# EAGLE schematic Pacman2-OSH-panels (EAGLE 9.2.2)
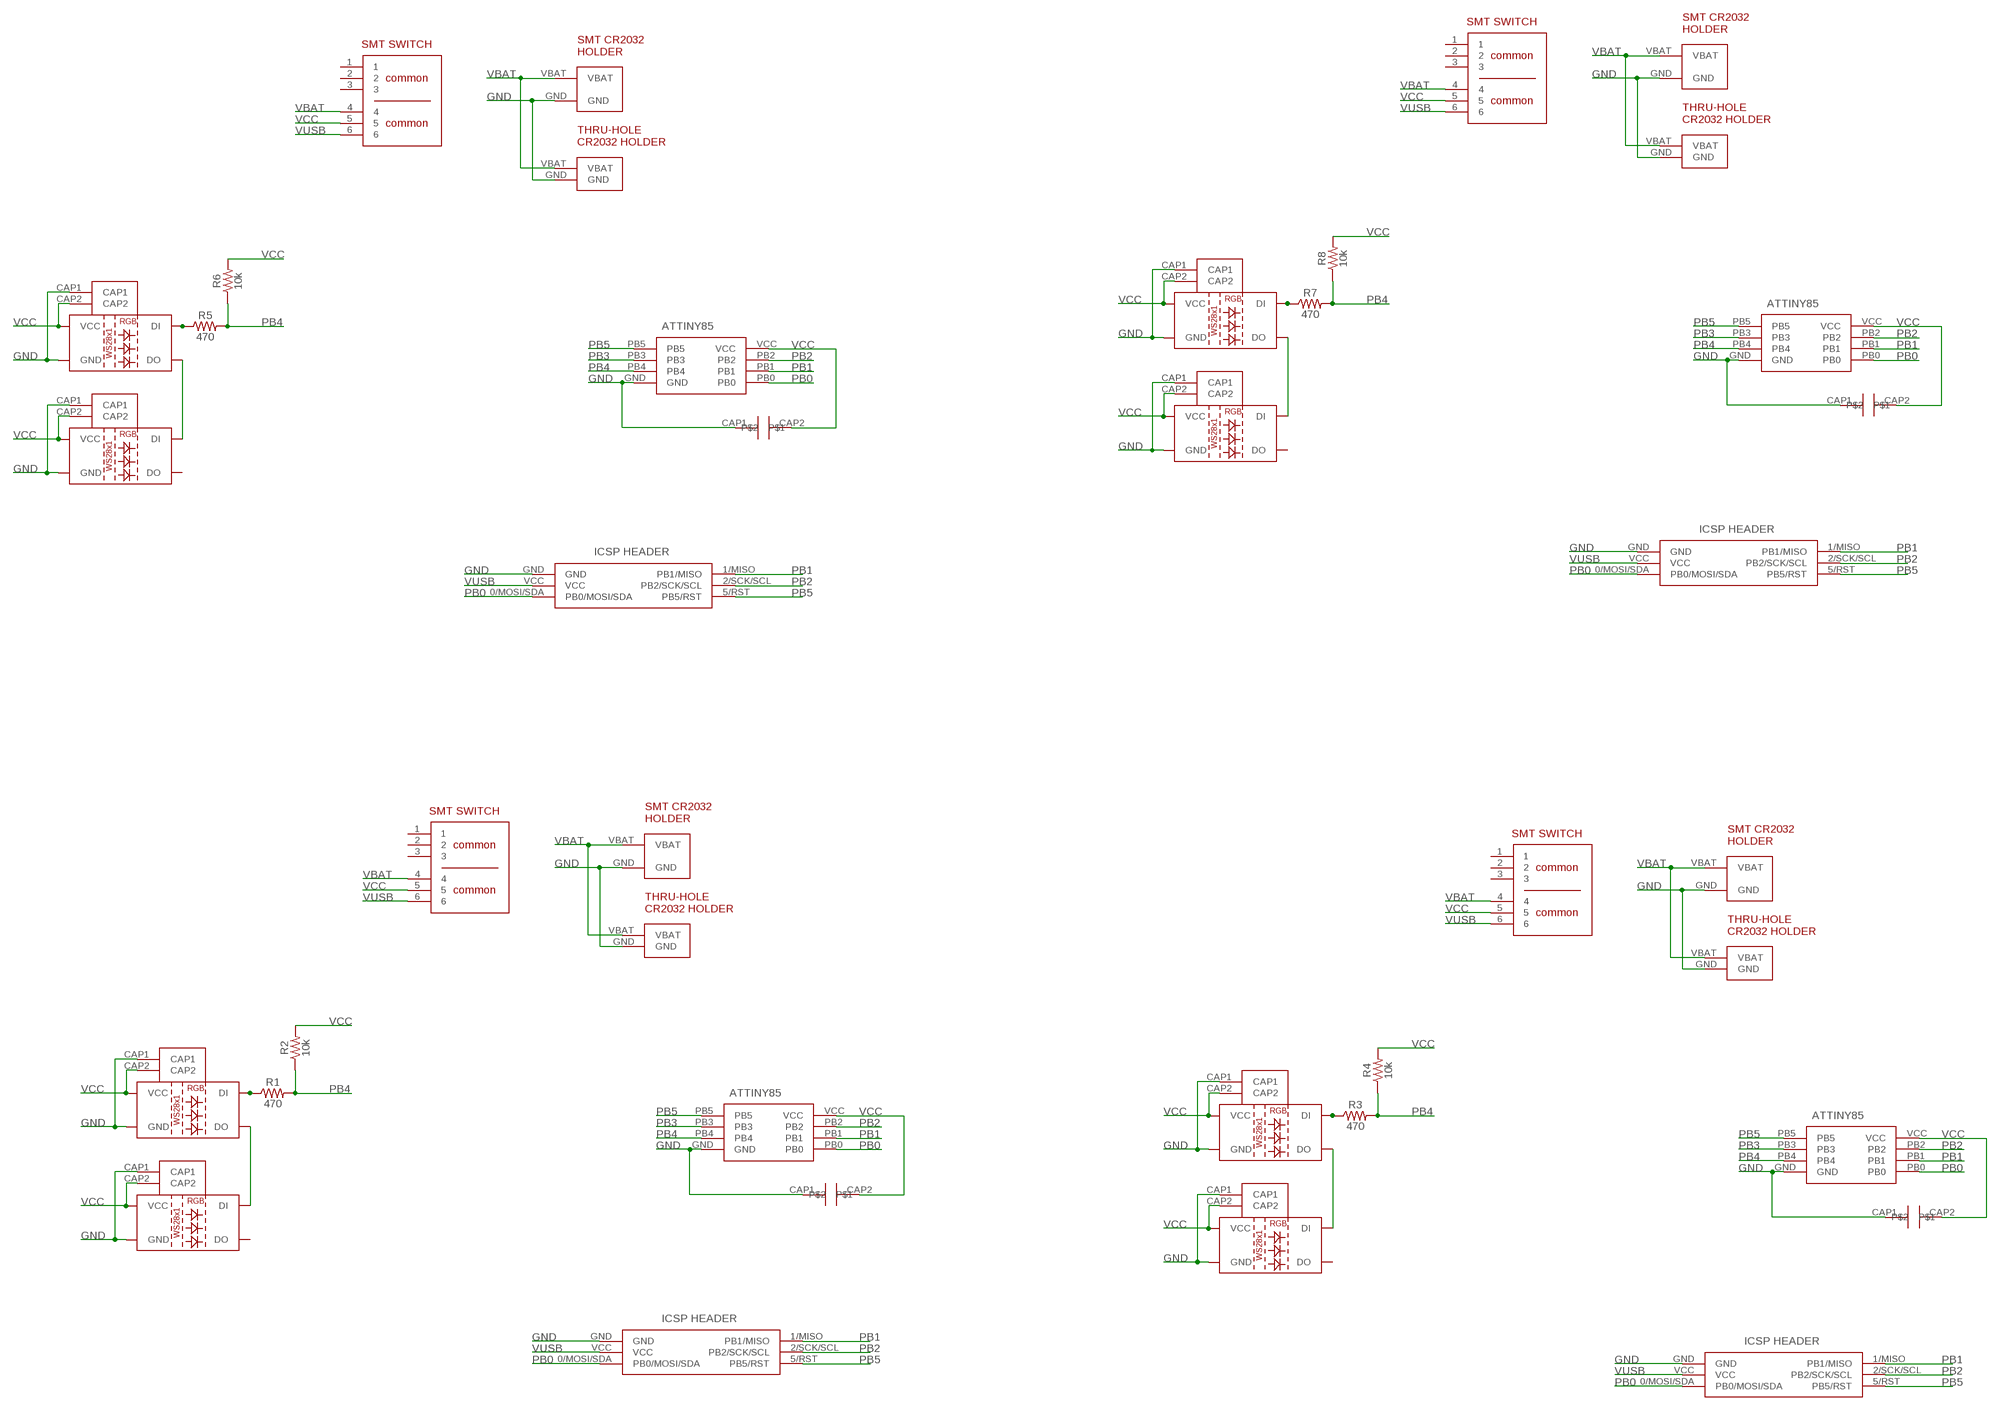
[diagram p0: schematic, sheet 1]

## Parts
D1  WS2812B  [WS2812B]
D2  WS2812B  [WS2812B]
D3  WS2812B  [WS2812B]
D4  WS2812B  [WS2812B]
D5  WS2812B  [WS2812B]
D6  WS2812B  [WS2812B]
D7  WS2812B  [WS2812B]
D8  WS2812B  [WS2812B]
DECOUPLER  .1uf  0603-CAP  [0603-CAP]
DECOUPLER1  .1uf  0603-CAP  [0603-CAP]
DECOUPLER2  .1uf  0603-CAP  [0603-CAP]
DECOUPLER3  .1uf  0603-CAP  [0603-CAP]
IC1  ATTINY85-20SU  [SOT127P798X216-8N]
IC2  ATTINY85-20SU  [SOT127P798X216-8N]
IC3  ATTINY85-20SU  [SOT127P798X216-8N]
IC4  ATTINY85-20SU  [SOT127P798X216-8N]
J1  ICSP-LO-SILK  [ICSP-LO-SILK]
J2  ICSP-LO-SILK  [ICSP-LO-SILK]
J3  ICSP-LO-SILK  [ICSP-LO-SILK]
J4  ICSP-LO-SILK  [ICSP-LO-SILK]
R1  470  470OHM-0603-1/10W-1%  [0603]
R2  10k  10KOHM-0603-1/10W-1%  [0603]
R3  470  470OHM-0603-1/10W-1%  [0603]
R4  10k  10KOHM-0603-1/10W-1%  [0603]
R5  470  470OHM-0603-1/10W-1%  [0603]
R6  10k  10KOHM-0603-1/10W-1%  [0603]
R7  470  470OHM-0603-1/10W-1%  [0603]
R8  10k  10KOHM-0603-1/10W-1%  [0603]
U$1  SMT-SWITCH  [SMT-SWITCH]
U$2  SMT-BATTERY-HOLDER  [SMT-CR-HOLDER]
U$3  THRU-CR-HOLDER  [THRU-CR-HOLDER]
U$4  SMT-BATTERY-HOLDER  [SMT-CR-HOLDER]
U$5  THRU-CR-HOLDER  [THRU-CR-HOLDER]
U$6  SMT-SWITCH  [SMT-SWITCH]
U$7  SMT-BATTERY-HOLDER  [SMT-CR-HOLDER]
U$8  THRU-CR-HOLDER  [THRU-CR-HOLDER]
U$9  SMT-SWITCH  [SMT-SWITCH]
U$10  SMT-BATTERY-HOLDER  [SMT-CR-HOLDER]
U$11  THRU-CR-HOLDER  [THRU-CR-HOLDER]
U$145  SMT-SWITCH  [SMT-SWITCH]

## Nets
GND [GND]: D1.CAP1 D1.GND D2.CAP1 D2.GND D3.CAP1 D3.GND D4.CAP1 D4.GND D5.CAP1 D5.GND D6.CAP1 D6.GND D7.CAP1 D7.GND D8.CAP1 D8.GND DECOUPLER1.CAP1 DECOUPLER2.CAP1 DECOUPLER3.CAP1 DECOUPLER.CAP1 IC1.GND IC2.GND IC3.GND IC4.GND J1.GND J2.GND J3.GND J4.GND U$2.GND U$3.GND U$4.GND U$5.GND U$7.GND U$8.GND U$10.GND U$11.GND
N$1: D3.DO D4.DI
N$2: D3.DI R3.1
N$3: D1.DO D2.DI
N$4: D5.DO D6.DI
N$5: D1.DI R1.1
N$6: D5.DI R5.1
N$7: D7.DO D8.DI
N$8: D7.DI R7.1
PB0: IC1.PB0 IC2.PB0 IC3.PB0 IC4.PB0 J1.0/MOSI/SDA(PB0/MOSI/SDA) J2.0/MOSI/SDA(PB0/MOSI/SDA) J3.0/MOSI/SDA(PB0/MOSI/SDA) J4.0/MOSI/SDA(PB0/MOSI/SDA)
PB1: IC1.PB1 IC2.PB1 IC3.PB1 IC4.PB1 J1.1/MISO(PB1/MISO) J2.1/MISO(PB1/MISO) J3.1/MISO(PB1/MISO) J4.1/MISO(PB1/MISO)
PB2: IC1.PB2 IC2.PB2 IC3.PB2 IC4.PB2 J1.2/SCK/SCL(PB2/SCK/SCL) J2.2/SCK/SCL(PB2/SCK/SCL) J3.2/SCK/SCL(PB2/SCK/SCL) J4.2/SCK/SCL(PB2/SCK/SCL)
PB3: IC1.PB3 IC2.PB3 IC3.PB3 IC4.PB3
PB4: IC1.PB4 IC2.PB4 IC3.PB4 IC4.PB4 R1.2 R2.1 R3.2 R4.1 R5.2 R6.1 R7.2 R8.1
PB5: IC1.PB5 IC2.PB5 IC3.PB5 IC4.PB5 J1.5/RST(PB5/RST) J2.5/RST(PB5/RST) J3.5/RST(PB5/RST) J4.5/RST(PB5/RST)
VBAT [VBAT]: U$1.4 U$2.VBAT U$3.VBAT U$4.VBAT U$5.VBAT U$6.4 U$7.VBAT U$8.VBAT U$9.4 U$10.VBAT U$11.VBAT U$145.4
VCC [VCC]: D1.CAP2 D1.VCC D2.CAP2 D2.VCC D3.CAP2 D3.VCC D4.CAP2 D4.VCC D5.CAP2 D5.VCC D6.CAP2 D6.VCC D7.CAP2 D7.VCC D8.CAP2 D8.VCC DECOUPLER1.CAP2 DECOUPLER2.CAP2 DECOUPLER3.CAP2 DECOUPLER.CAP2 IC1.VCC IC2.VCC IC3.VCC IC4.VCC R2.2 R4.2 R6.2 R8.2 U$1.5 U$6.5 U$9.5 U$145.5
VUSB: J1.VCC J2.VCC J3.VCC J4.VCC U$1.6 U$6.6 U$9.6 U$145.6
Unconnected: D2.DO D4.DO D6.DO D8.DO U$1.1 U$1.2 U$1.3 U$6.1 U$6.2 U$6.3 U$9.1 U$9.2 U$9.3 U$145.1 U$145.2 U$145.3

## Library data of the parts
D1-D8 = BadgeParts:WS2812B: WS2812B SMD addressable RGB LED 5x5mm SMD LED with built-in controller IC. Color: Red/Green/Blue mC Rating: RGB: 390, 660, 180 mcd Forward Voltage: RGB: 2.0, 3.0, 3.0 V Packages:WS2812B SparkFun Products: Blynk Board - ESP8266 <https://www.sparkfun.com/products/13794>; PROD_ID: DIO-12503
DECOUPLER DECOUPLER1-DECOUPLER3 = BadgeParts:0603-CAP
IC1-IC4 = BadgeParts:ATTINY85-20SU: MICROCHIP - ATTINY85-20SU - MICROCONTROLLER MCU, 8 BIT, ATTINY, 20MHZ, SOIC-8 Source: Datasheet <https://componentsearchengine.com/Datasheets/2/ATTINY85-20SU.pdf>; ARROW_PART_NUMBER: ATTINY85-20SU; ARROW_PRICE/STOCK: https://www.arrow.com/en/products/attiny85-20su/microchip-technology; DESCRIPTION: MICROCHIP - ATTINY85-20SU - MICROCONTROLLER MCU, 8 BIT, ATTINY, 20MHZ, SOIC-8; HEIGHT: 2.16mm; MANUFACTURER_NAME: Microchip; MANUFACTURER_PART_NUMBER: ATTINY85-20SU; RS_PART_NUMBER: 1331674; RS_PRICE/STOCK: http://uk.rs-online.com/web/p/products/1331674
J1-J4 = BadgeParts:ICSP-LO-SILK: 03+03 DIL Vertical Pin Header HARWIN M20 Series, 2.54mm Pitch 6 Way 2 Row Straight PCB Header, Solder Termination, 3A Source: Datasheet <https://cdn.harwin.com/pdfs/M20-998.pdf?utm_source=3D_PDF&utm_medium=3D_PDF&utm_campaign=3D_PDF>
R1 R3 R5 R7 = SparkFun-Resistors:470OHM: 470Ω resistor A resistor is a passive two-terminal electrical component that implements electrical resistance as a circuit element. Resistors act to reduce current flow, and, at the same time, act to lower voltage levels within circuits. - Wikipedia; PROD_ID: RES-07869
R2 R4 R6 R8 = SparkFun-Resistors:10KOHM: 10kΩ resistor A resistor is a passive two-terminal electrical component that implements electrical resistance as a circuit element. Resistors act to reduce current flow, and, at the same time, act to lower voltage levels within circuits. - Wikipedia; PROD_ID: RES-00824
U$1 U$6 U$9 U$145 = BadgeParts:SMT-SWITCH
U$2 U$4 U$7 U$10 = BadgeParts:SMT-BATTERY-HOLDER
U$3 U$5 U$8 U$11 = BadgeParts:THRU-CR-HOLDER

## Net classes
0 default: width 0.254 mm, clearance 0.254 mm
1 VCC: width 0.381 mm, clearance 0.254 mm
2 GND: width 0.381 mm, clearance 0.254 mm
3 VBAT: width 0.381 mm, clearance 0.254 mm